# Altium schematic sheet DRIVER_B.SchDoc
size 420 x 297 mm; SheetNumber: 3; PageSetup: Record=PageOptions|CenterHorizontal=False|CenterVertical=False|PrintScale=0.95|XCorrection=0.00|YCorrection=0.00|PrintKind=1|BorderSize=5000000|LeftOffset=0|BottomOffset=0|Orientation=1|PaperLength=1000|PaperWidth=1000|Scale=100|PaperSource=15|PrintQuality=600|MediaType=1|DitherType=10|PaperKind=A4|PrintScaleMode=1
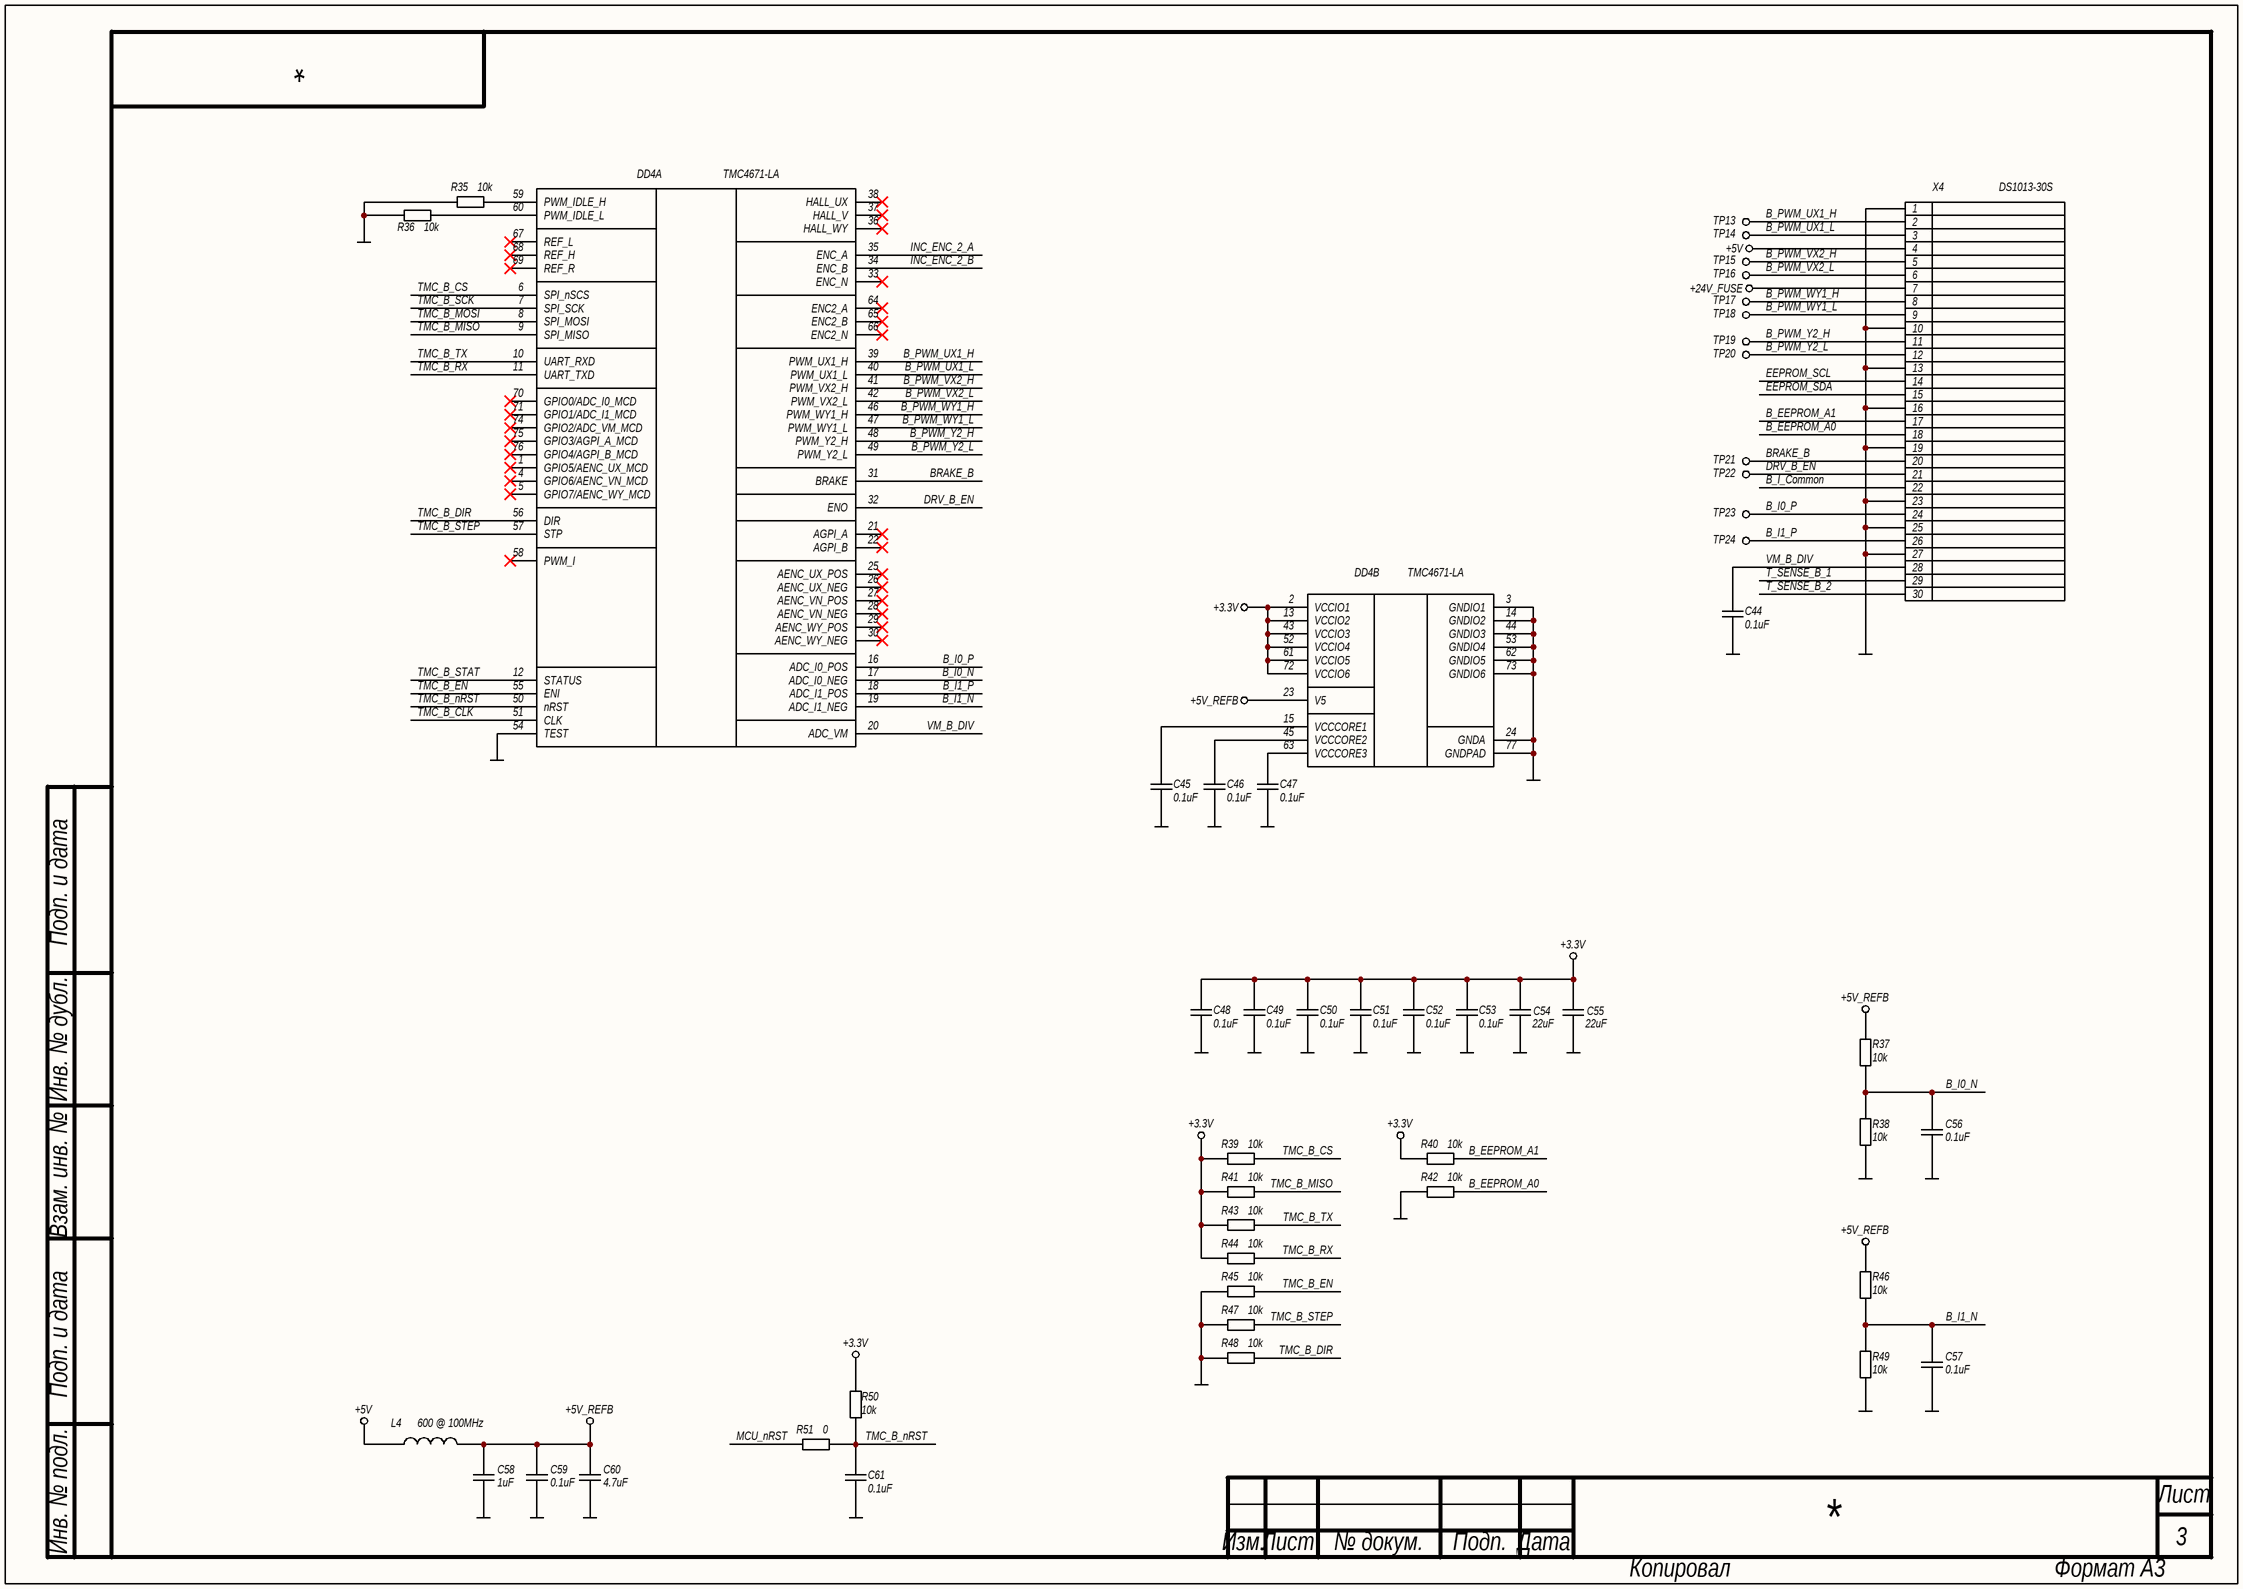
[diagram p0: DRIVER_B.SchDoc]

## Parts
C44  0.1uF  [C0603N]
C45  0.1uF  [C0603N]
C46  0.1uF  [C0603N]
C47  0.1uF  [C0603N]
C48  0.1uF  [C0603N]
C49  0.1uF  [C0603N]
C50  0.1uF  [C0603N]
C51  0.1uF  [C0603N]
C52  0.1uF  [C0603N]
C53  0.1uF  [C0603N]
C54  22uF  [C0805N]
C55  22uF  [C0805N]
C56  0.1uF  [C0603N]
C57  0.1uF  [C0603N]
C58  1uF  [C0603N]
C59  0.1uF  [C0603N]
C60  4.7uF  [C0603N]
C61  0.1uF  [C0603N]
DD4  TMC4671-LA  [QFN76-EP]  (parts A,B of 2)
L4  600 @ 100MHz  [FB0603N]
R35  10k  [R0603N]
R36  10k  [R0603N]
R37  10k  [R0603N]
R38  10k  [R0603N]
R39  10k  [R0603N]
R40  10k  [R0603N]
R41  10k  [R0603N]
R42  10k  [R0603N]
R43  10k  [R0603N]
R44  10k  [R0603N]
R45  10k  [R0603N]
R46  10k  [R0603N]
R47  10k  [R0603N]
R48  10k  [R0603N]
R49  10k  [R0603N]
R50  10k  [R0603N]
R51  0  [R0603N]
TP13  TEST_POINT  [TP_RPAD_0.8MM]  (value not drawn)  (no BOM)
TP14  TEST_POINT  [TP_RPAD_0.8MM]  (value not drawn)  (no BOM)
TP15  TEST_POINT  [TP_RPAD_0.8MM]  (value not drawn)  (no BOM)
TP16  TEST_POINT  [TP_RPAD_0.8MM]  (value not drawn)  (no BOM)
TP17  TEST_POINT  [TP_RPAD_0.8MM]  (value not drawn)  (no BOM)
TP18  TEST_POINT  [TP_RPAD_0.8MM]  (value not drawn)  (no BOM)
TP19  TEST_POINT  [TP_RPAD_0.8MM]  (value not drawn)  (no BOM)
TP20  TEST_POINT  [TP_RPAD_0.8MM]  (value not drawn)  (no BOM)
TP21  TEST_POINT  [TP_RPAD_0.8MM]  (value not drawn)  (no BOM)
TP22  TEST_POINT  [TP_RPAD_0.8MM]  (value not drawn)  (no BOM)
TP23  TEST_POINT  [TP_RPAD_0.8MM]  (value not drawn)  (no BOM)
TP24  TEST_POINT  [TP_RPAD_0.8MM]  (value not drawn)  (no BOM)
X4  DS1013-30S  [2.54_2X15_HEADER_BOX]

## Nets
+3.3V: C48.2 C49.2 C50.2 C51.2 C52.2 C53.2 C54.2 C55.2 DD4.2(VCCIO1) DD4.13(VCCIO2) DD4.43(VCCIO3) DD4.52(VCCIO4) DD4.61(VCCIO5) DD4.72(VCCIO6) R39.2 R40.2 R41.2 R43.2 R44.2 R50.2
+5V: L4.1 X4.4
+5V_REFB: C58.2 C59.2 C60.2 DD4.23(V5) L4.2 R37.2 R46.2
+24V_FUSE: X4.7
GND: C44.1 C45.1 C46.1 C47.1 C48.1 C49.1 C50.1 C51.1 C52.1 C53.1 C54.1 C55.1 C56.1 C57.1 C58.1 C59.1 C60.1 C61.1 DD4.3(GNDIO1) DD4.14(GNDIO2) DD4.24(GNDA) DD4.44(GNDIO3) DD4.53(GNDIO4) DD4.54(TEST) DD4.62(GNDIO5) DD4.73(GNDIO6) DD4.77(GNDPAD) R35.2 R36.2 R38.1 R42.2 R45.2 R47.2 R48.2 R49.1 X4.1 X4.10 X4.13 X4.16 X4.19 X4.23 X4.25 X4.27
B_EEPROM_A0: R42.1 X4.18
B_EEPROM_A1: R40.1 X4.17
B_I0_N: C56.2 DD4.17(ADC_I0_NEG) R37.1 R38.2
B_I0_P: DD4.16(ADC_I0_POS) TP23.1 X4.24
B_I1_N: C57.2 DD4.19(ADC_I1_NEG) R46.1 R49.2
B_I1_P: DD4.18(ADC_I1_POS) TP24.1 X4.26
B_I_Common: X4.22
B_PWM_UX1_H: DD4.39(PWM_UX1_H) TP13.1 X4.2
B_PWM_UX1_L: DD4.40(PWM_UX1_L) TP14.1 X4.3
B_PWM_VX2_H: DD4.41(PWM_VX2_H) TP15.1 X4.5
B_PWM_VX2_L: DD4.42(PWM_VX2_L) TP16.1 X4.6
B_PWM_WY1_H: DD4.46(PWM_WY1_H) TP17.1 X4.8
B_PWM_WY1_L: DD4.47(PWM_WY1_L) TP18.1 X4.9
B_PWM_Y2_H: DD4.48(PWM_Y2_H) TP19.1 X4.11
B_PWM_Y2_L: DD4.49(PWM_Y2_L) TP20.1 X4.12
BRAKE_B: DD4.31(BRAKE) TP21.1 X4.20
DRV_B_EN: DD4.32(ENO) TP22.1 X4.21
EEPROM_SCL: X4.14
EEPROM_SDA: X4.15
INC_ENC_2_A: DD4.35(ENC_A)
INC_ENC_2_B: DD4.34(ENC_B)
MCU_nRST: R51.2
T_SENSE_B_1: X4.29
T_SENSE_B_2: X4.30
TMC_B_CLK: DD4.51(CLK)
TMC_B_CS: DD4.6(SPI_nSCS) R39.1
TMC_B_DIR: DD4.56(DIR) R48.1
TMC_B_EN: DD4.55(ENI) R45.1
TMC_B_MISO: DD4.9(SPI_MISO) R41.1
TMC_B_MOSI: DD4.8(SPI_MOSI)
TMC_B_nRST: C61.2 DD4.50(nRST) R50.1 R51.1
TMC_B_RX: DD4.11(UART_TXD) R44.1
TMC_B_SCK: DD4.7(SPI_SCK)
TMC_B_STAT: DD4.12(STATUS)
TMC_B_STEP: DD4.57(STP) R47.1
TMC_B_TX: DD4.10(UART_RXD) R43.1
VM_B_DIV: C44.2 DD4.20(ADC_VM) X4.28
NetC45_2: C45.2 DD4.15(VCCCORE1)
NetC46_2: C46.2 DD4.45(VCCCORE2)
NetC47_2: C47.2 DD4.63(VCCCORE3)
NetDD4_59: DD4.59(PWM_IDLE_H) R35.1
NetDD4_60: DD4.60(PWM_IDLE_L) R36.1

Not connected (* = marked no-connect by the designer): DD4 1(GPIO5/AENC_UX_MCD)* 4(GPIO6/AENC_VN_MCD)* 5(GPIO7/AENC_WY_MCD)* 21(AGPI_A)* 22(AGPI_B)* 25(AENC_UX_POS)* 26(AENC_UX_NEG)* 27(AENC_VN_POS)* 28(AENC_VN_NEG)* 29(AENC_WY_POS)* 30(AENC_WY_NEG)* 33(ENC_N)* 36(HALL_WY)* 37(HALL_V)* 38(HALL_UX)* 58(PWM_I)* 64(ENC2_A)* 65(ENC2_B)* 66(ENC2_N)* 67(REF_L)* 68(REF_H)* 69(REF_R)* 70(GPIO0/ADC_I0_MCD)* 71(GPIO1/ADC_I1_MCD)* 74(GPIO2/ADC_VM_MCD)* 75(GPIO3/AGPI_A_MCD)* 76(GPIO4/AGPI_B_MCD)*

## Notes on the sheet
- Подп. и дата
- Инв. № дубл.
- Взам. инв. №
- Инв. № подл.
- Лист
- Изм.
- № докум.
- Подп.
- Дата
- Копировал
- Формат А3

## Library data of the parts
C44-C53 C56 C57 C59 C61 = CL10B104KB8NNNC: Конденсатор; Точность: 10%; Напряжение: 50V; Диэлектрик: X7R; Производитель: Samsung Electro-Mechanics; Описание: 0.1 µF ±10% 50V Ceramic Capacitor X7R 0603 (1608 Metric); Корпус: 0603 (1608 Metric); Температурный диапазон: -55°C ~ 125°C; Вид монтажа: SMD; Артикул: CL10B104KB8NNNC; Номинал: 0.1uF; Строка для документации: https://mm.digikey.com/Volume0/opasdata/d220001/medias/docus/609/CL10B104KB8NNNC_Spec.pdf; Тип элемента: Конденсатор
C54 C55 = CL21A226MOCLRNC: Конденсатор; Точность: 20%; Напряжение: 16V; Диэлектрик: X5R; Производитель: Samsung Electro-Mechanics; Описание: 22 µF ±20% 16V Ceramic Capacitor X5R 0805 (2012 Metric); Корпус: 0805 (2012 Metric); Температурный диапазон: -55°C ~ 85°C; Вид монтажа: SMD; Артикул: CL21A226MOCLRNC; Номинал: 22uF; Строка для документации: https://mm.digikey.com/Volume0/opasdata/d220001/medias/docus/43/CL21A226MOCLRNC_Spec.pdf; Тип элемента: Конденсатор
C58 = CL10B105KO8NNNC: Конденсатор; Точность: 10%; Напряжение: 16V; Диэлектрик: X7R; Производитель: YAGEO; Описание: 1 µF ±10% 16V Ceramic Capacitor X7R 0603 (1608 Metric); Корпус: 0603 (1608 Metric); Температурный диапазон: -55°C ~ 125°C; Вид монтажа: SMD; Артикул: CL10B105KO8NNNC; Номинал: 1uF; Строка для документации: https://weblib.samsungsem.com/mlcc/mlcc-ec-data-sheet.do?partNumber=CL10B105KO8NNN; Тип элемента: Конденсатор
C60 = CL10A475KO8NNNC: Конденсатор; Точность: 10%; Напряжение: 16V; Диэлектрик: X5R; Производитель: Samsung Electro-Mechanics; Описание: 4.7 µF ±10% 16V Ceramic Capacitor X5R 0603 (1608 Metric); Корпус: 0603 (1608 Metric); Температурный диапазон: -55°C ~ 85°C; Вид монтажа: SMD; Артикул: CL10A475KO8NNNC; Номинал: 4.7uF; Строка для документации: https://mm.digikey.com/Volume0/opasdata/d220001/medias/docus/2328/CL10A475KO8NNNC_Spec.pdf; Тип элемента: Конденсатор
DD4 = TMC4671-LA: Микросхема драйвер двигателя; Производитель: Analog Devices Inc.; Описание: Multiphase Motor Driver Power MOSFET SPI, Step/Direction 76-QFN (10.5x6.5); Корпус: 76-VFQFN Exposed Pad; Температурный диапазон: -40°C ~ 125°C (TJ); Вид монтажа: SMD; Артикул: TMC4671-LA; Строка для документации: https://www.analog.com/media/en/technical-documentation/data-sheets/TMC4671-LA_datasheet_Rev2.07.pdf; Тип элемента: Микросхема
L4 = BLM18AG601SN1D: Фильтр ЭМП индуктивный; Ток: 500mA; Сопротивление: 380m; Тип: Ferrite Bead; Производитель: Murata Electronics; Описание: 600 Ohms @ 100 MHz 1 Ferrite Bead 0603 (1608 Metric) 500mA 380mOhm; Корпус: 0603 (1608 Metric); Температурный диапазон: -55°C ~ 125°C; Вид монтажа: SMD; Артикул: BLM18AG601SN1D; Номинал: 600 @ 100MHz; Строка для документации: https://www.murata.com/en-us/products/productdata/8796738650142/ENFA0003.pdf; Тип элемента: Фильтр ЭМП
R35-R50 = RC0603FR-0710KL: Резистор; Точность: 1%; ТКС: ±100ppm/°C; Напряжение: 75V; Производитель: YAGEO; Описание: 10 kOhms ±1% 0.1W, 1/10W Chip Resistor 0603 (1608 Metric) Moisture Resistant Thick Film; Корпус: 0603 (1608 Metric); Температурный диапазон: -55°C ~ 155°C; Вид монтажа: SMD; Артикул: RC0603FR-0710KL; Номинал: 10k; Строка для документации: https://www.yageo.com/upload/media/product/app/datasheet/rchip/pyu-rc_group_51_rohs_l.pdf; Тип элемента: Резистор
R51 = RC0603FR-070RL: Резистор; Точность: 1%; Напряжение: 75V; Производитель: YAGEO; Описание: 0 Ohms Jumper Chip Resistor 0603 (1608 Metric) Moisture Resistant Thick Film; Корпус: 0603 (1608 Metric); Температурный диапазон: -55°C ~ 155°C; Вид монтажа: SMD; Артикул: RC0603FR-070RL; Номинал: 0; Строка для документации: https://www.yageo.com/upload/media/product/app/datasheet/rchip/pyu-rc_group_51_rohs_l.pdf; Тип элемента: Резистор
TP13-TP24 = Test Point, Round Pad, 0.8mm diameter: Контрольная точка; Количество контактов: 1; Тип элемента: Разъем; Артикул: Test Point, Round Pad, 0.8mm diameter; Тип разъема: Test Point; Описание: Test Point, Round Pad, 0.8mm diameter
X4 = DS1013-30S: Разъем, 30 контактов; Тип разъема: Header, Male Pin; Количество контактов: 30; Шаг контактов: 2.54mm; Ток: 3A; Напряжение: 250V; Производитель: Connfly electronic (Zhenqin); Описание: Connector Header Through Hole 30 position 0.100" (2.54mm); Температурный диапазон: -40°C ~ 105°C; Вид монтажа: Through Hole; Артикул: DS1013-30S; Строка для документации: http://cn.connfly.group/static/upload/file/pdf/DS1013.pdf; Тип элемента: Разъем